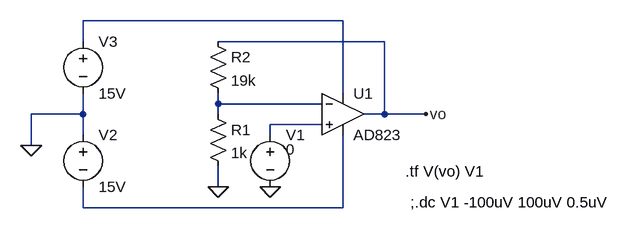
[diagram p0: schematic HW3.1.asc]
HW3.1.asc, the LTspice schematic file:
Version 4
SHEET 1 1064 680
WIRE 640 176 240 176
WIRE 240 208 240 176
WIRE 704 208 448 208
WIRE 640 288 640 176
WIRE 448 304 448 288
WIRE 608 304 448 304
WIRE 240 320 240 288
WIRE 240 320 160 320
WIRE 448 320 448 304
WIRE 704 320 704 208
WIRE 704 320 672 320
WIRE 768 320 704 320
WIRE 608 336 528 336
WIRE 240 352 240 320
WIRE 528 352 528 336
WIRE 160 368 160 320
WIRE 448 432 448 400
WIRE 240 464 240 432
WIRE 640 464 640 352
WIRE 640 464 240 464
FLAG 768 320 vo
FLAG 528 432 0
FLAG 448 432 0
FLAG 160 368 0
SYMBOL voltage 240 192 R0
SYMATTR InstName V3
SYMATTR Value 15V
SYMBOL voltage 240 336 R0
SYMATTR InstName V2
SYMATTR Value 15V
SYMBOL OpAmps/AD823 640 256 R0
SYMATTR InstName U1
SYMBOL Voltage 528 336 R0
WINDOW 3 24 38 Left 2
SYMATTR Value 0
SYMATTR InstName V1
SYMBOL res 432 304 R0
SYMATTR InstName R1
SYMATTR Value 1k
SYMBOL res 432 192 R0
SYMATTR InstName R2
SYMATTR Value 19k
TEXT 736 408 Left 2 !.tf V(vo) V1
TEXT 744 456 Left 2 !;.dc V1 -100uV 100uV 0.5uV

The netlist it stands for:
* HW3.1.asc
V3 N001 0 15V
V2 0 N004 15V
XU1 N003 N002 N001 N004 vo AD823  ; pins In+ In- V+ V- OUT
V1 N003 0 0
R1 N002 0 1k
R2 vo N002 19k
.tf V(vo) V1
;.dc V1 -100uV 100uV 0.5uV
.lib ADI.lib
.backanno
.end